# Altium schematic sheet Mainboard_Motordriver_Interface.SchDoc
size A4
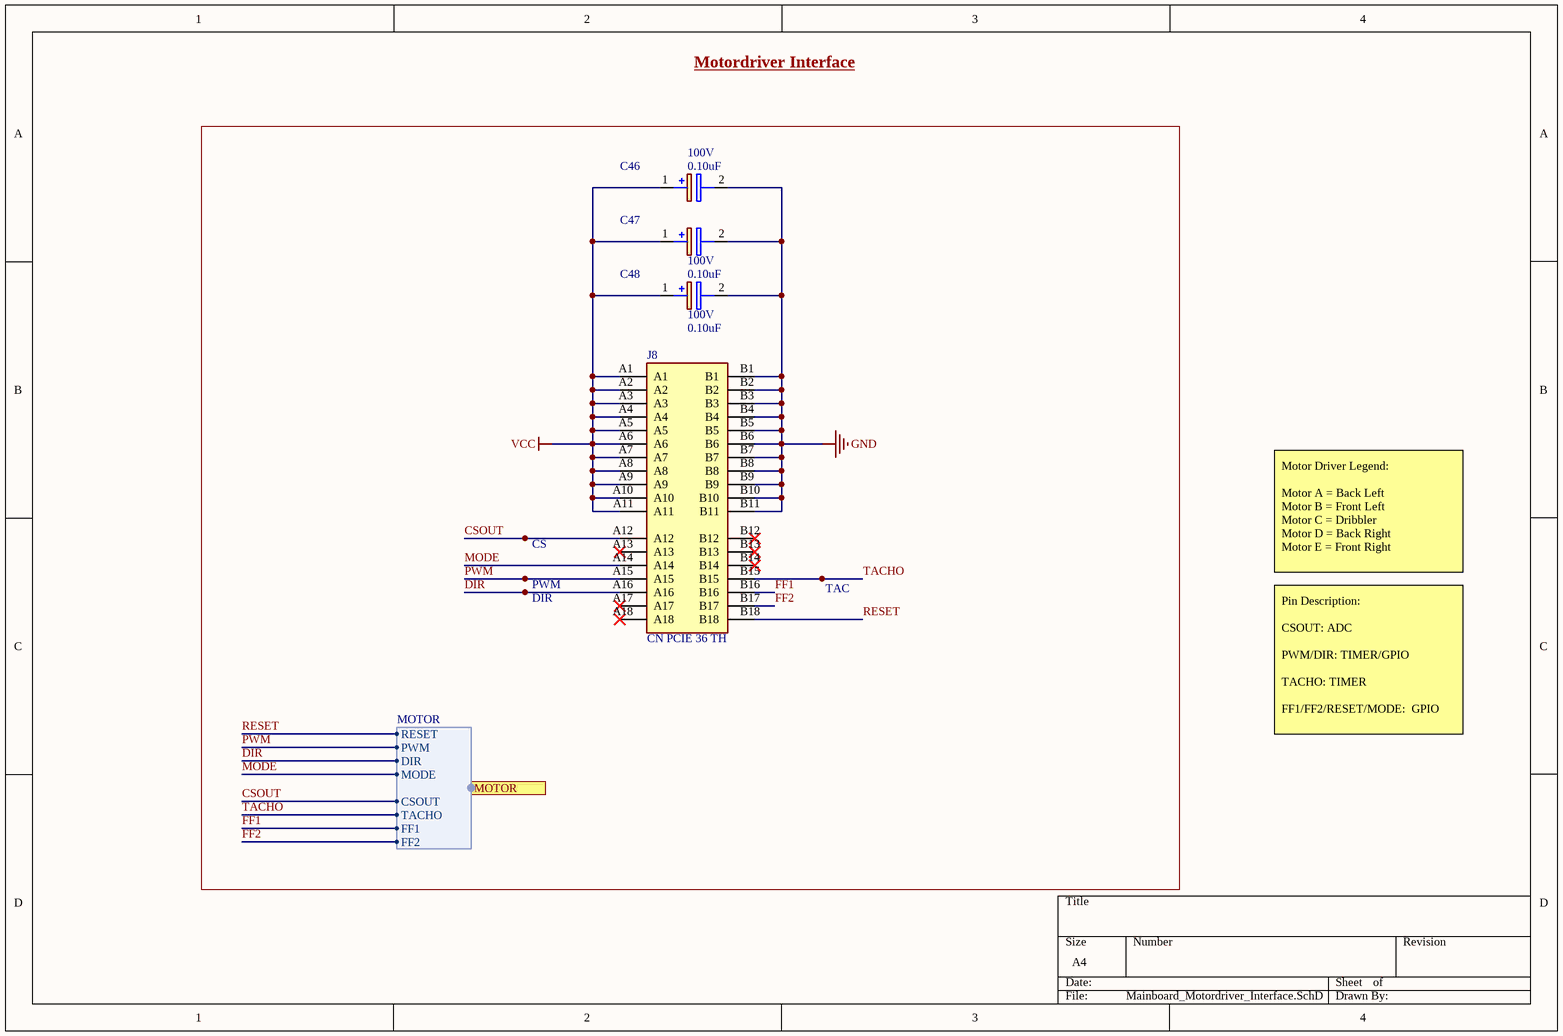
[diagram p0: Mainboard_Motordriver_Interface.SchDoc]

## Parts
C46  value 0.10uF  Rating: 100V  [CAPPRD200W50D525H1250]  (hidden comment: CAP POL 0.1uF 100V)
C47  value 0.10uF  Rating: 100V  [CAPPRD200W50D525H1250]  (hidden comment: CAP POL 0.1uF 100V)
C48  value 0.10uF  Rating: 100V  [CAPPRD200W50D525H1250]  (hidden comment: CAP POL 0.1uF 100V)
CS  Test Point (Via)  [TP]  (value not drawn)
DIR  Test Point (Via)  [TP]  (value not drawn)
J8  CN PCIE 36 TH  [CN PCIE 36 TH]
PWM  Test Point (Via)  [TP]  (value not drawn)
TAC  Test Point (Via)  [TP]  (value not drawn)

## Ports
MOTOR (harness MOTOR)

## Harnesses
MOTOR: DIR, MODE, TACHO, FF1, FF2, PWM, RESET, CSOUT

## Nets
GND: C46.2(-) C47.2(-) C48.2(-) J8.B1 J8.B2 J8.B3 J8.B4 J8.B5 J8.B6 J8.B7 J8.B8 J8.B9 J8.B10 J8.B11
VCC: C46.1(+) C47.1(+) C48.1(+) J8.A1 J8.A2 J8.A3 J8.A4 J8.A5 J8.A6 J8.A7 J8.A8 J8.A9 J8.A10 J8.A11
CSOUT: CS.1 J8.A12 ; port MOTOR.CSOUT
DIR: DIR.1 J8.A16 ; port MOTOR.DIR
FF1: J8.B16 ; port MOTOR.FF1
FF2: J8.B17 ; port MOTOR.FF2
MODE: J8.A14 ; port MOTOR.MODE
PWM: J8.A15 PWM.1 ; port MOTOR.PWM
RESET: J8.B18 ; port MOTOR.RESET
TACHO: J8.B15 TAC.1 ; port MOTOR.TACHO

Not connected (* = marked no-connect by the designer): J8 A13* A17* A18* B12* B13* B14*

## Notes on the sheet
- Motordriver Interface
- Motor Driver Legend:
  Motor A = Back Left
  Motor B = Front Left
  Motor C = Dribbler
  Motor D = Back Right
  Motor E = Front Right
- Pin Description:
  CSOUT: ADC
  PWM/DIR: TIMER/GPIO
  TACHO: TIMER
  FF1/FF2/RESET/MODE:  GPIO

## Library data of the parts
C46-C48 = CAP POL 0.1uF 100V: 0.1µF 100V Aluminum Electrolytic Capacitors, Through-Hole, Radial, Can 2000 Hrs @ 85°C; Manufacturer_Name: Nichicon; Manufacturer_Part_Number: UKL2A0R1KDD; Datasheet Link: http://www.mouser.com/ds/2/293/e-ukl-876305.pdf; Height: 12.5mm; Mouser Part Number: 647-UKL2A0R1KDD; Mouser Price/Stock: https://www.mouser.com/Search/Refine.aspx?Keyword=647-UKL2A0R1KDD; Supplier 1: Digi-Key; Supplier Part Number 1: 493-16876-ND
J8 = CN PCIE 36 TH: 36 Position Female Connector PCI Expressâ„¢ Gold 0.039 _1.00mm_ Black 10018784-10210TLF; MF: Amphenol ICC; Price: None; SnapEDA_Link: https://www.snapeda.com/parts/10018784-10210TLF/Amphenol%20FCI/view-part/520950/?ref=snap; Availability: Unavailable; MP: 10018784-10210TLF; Package: None; Value: *